# Altium schematic sheet TempRFOut.SchDoc
size A4; DrawnBy: LSR; Engineer: CW; SheetNumber: 1; SheetTotal: 1; PageSetup: Record=PageOptions|CenterHorizontal=True|CenterVertical=True|PrintScale=1.00|XCorrection=1.00|YCorrection=1.00|PrintKind=0|BorderSize=5000000|LeftOffset=0|BottomOffset=0|Orientation=2|PaperLength=1000|PaperWidth=1000|Scale=100|PaperSource=7|PrintQuality=-3|MediaType=1|DitherType=10|PrintScaleMode=1|PaperKind=A4|PaperIndex=9
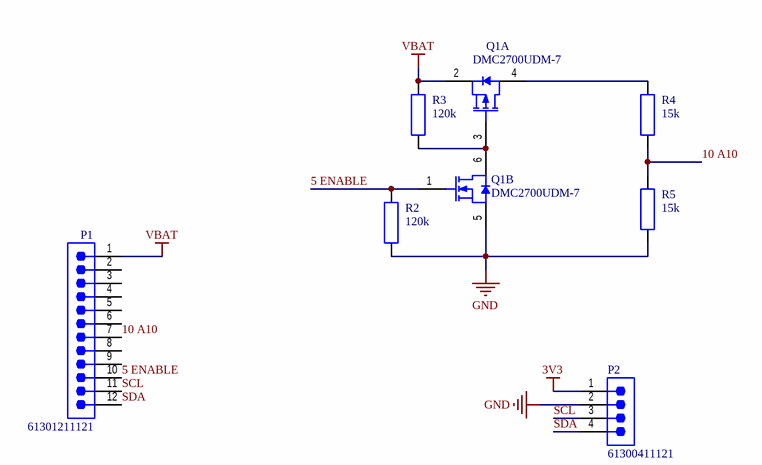
[diagram p0: TempRFOut.SchDoc]

## Parts
P1  61301211121  [61301211121]
P2  61300411121  [61300411121]
Q1  DMC2700UDM-7  [FAIR-SOT23-6_V]  (parts A,B of 2)
R2  120k  [0603]
R3  120k  [0603]
R4  15k  [0603]
R5  15k  [0603]

## Nets
3V3: P2.1
GND: P2.2 Q1.5(S) R2.1 R5.1
VBAT: P1.1 Q1.2(S) R3.2
5 ENABLE: P1.10 Q1.1(G) R2.2
10 A10: P1.7 R4.1 R5.2
SCL: P1.11 P2.3
SDA: P1.12 P2.4
NetQ1_3: Q1.3(G) Q1.6(D) R3.1
NetQ1_4: Q1.4(D) R4.2

Not connected (* = marked no-connect by the designer): P1 2 3 4 5 6 8 9

## Notes on the sheet
- CONFIDENTIAL
- Reference No:
- Date:
- File:
- Sheet
- Revision:
- Drawn by:
- of

## Library data of the parts
P1 = CMP-1502-01086-4: THT Vertical Pin Header WR-PHD, Pitch 2.54 mm, Single Row, 12 pins; Connector Type: Male Pin; Current Rating: 3A; Gender: Male; Contact Resistance: 20mΩ; Operating Supply Voltage: 250V; Number of Positions: 12; Pitch: 2.54mm; Orientation: Vertical; Contact Mating Length: 5.9944mm; Number of Pins: 12; Number of Rows: 1; Contact Plating: Gold; Mount: Through Hole; Termination: Solder; RoHS: Compliant; Color: Black; Packaging: Bulk; Lead Pitch: 2.54mm; Number of Contacts: 12; Contact Material: Copper
P2 = CMP-1502-01064-4: THT Vertical Pin Header WR-PHD, Pitch 2.54 mm, Single Row, 4 pins; Connector Type: Male Pin; Gender: Male; Current Rating: 3A; Number of Positions: 4; Operating Supply Voltage: 250V; Contact Resistance: 20mΩ; Pitch: 2.54mm; Max Operating Temperature: 105°C; Mount: Through Hole; Contact Material: Gold; Contact Plating: Gold; Number of Contacts: 4; Orientation: Vertical; Packaging: Bulk; Contact Mating Length: 5.9944mm; Voltage Rating: 250V; Number of Rows: 1; Height: 8.89mm; Lead Free: Lead Free; Lead Pitch: 2.54mm; Number of Pins: 4; Color: Black; Min Operating Temperature: -40°C; RoHS: Compliant; Termination: Solder
Q1 = CMP-2000-04939-1: Dual N & P-Channel 2.5 V Specified PowerTrench(TM) MOSFET, -55 to 150 degC, 6-Pin SOT-23, RoHS, Tape and Reel; Manufacturer: Fairchild; Typical Rise Time: 9@NChannel; Rad Hard: No; Maximum Drain Source Voltage: 20V; Typical Fall Time: 3@NChannel; Typical Turn-On Delay Time: 5@NChannel; Maximum Continuous Drain Current: 2.7@NChannel; Typical Turn-Off Delay Time: 12@NChannel; RDS-on: 80@4.5V@NChannel; Channel Mode: Enhancement; Maximum Gate Source Voltage: ±8V; Package Version: Rev. 5, 05/2015; Operating Temperature: -55to150degC; Packaging: Tape&Reel; Package Reference: SOT23-6; Package URL: https://www.fairchildsemi.com/package-drawings/MA/MA06A.pdf; Package Description: 6-Pin Small Outline Transistor, Body 2.9 x 1.6 mm, Pitch 0.95 mm; Manufacturer URL: https://www.fairchildsemi.com/; Channel Type: N; Datasheet Version: Rev. E, 07/2000; Package: 6SuperSOT; Datasheet URL: https://www.fairchildsemi.com/datasheets/FD/FDC6327C.pdf; Mounting: SurfaceMount; Category: MOSFET
R2-R5 = R: Resistor; ComponentLink1URL: http://www.yageo.com/documents/recent/PYu-RC_Group_51_RoHS_L_7.pdf; ComponentLink1Description: http://www.yageo.com/documents/recent/PYu-RC_Group_51_RoHS_L_7.pdf